# EAGLE schematic crap (EAGLE 9.3.1)
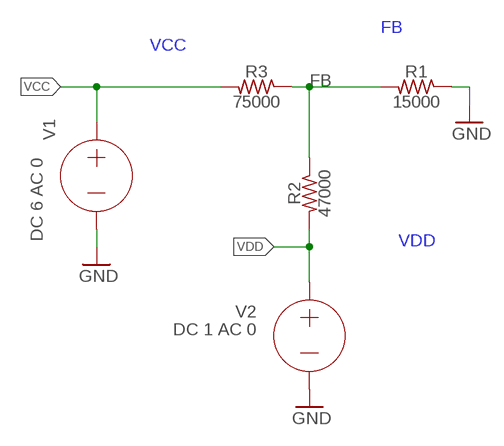
[diagram p0: schematic, sheet 1]

## Parts
R1  15000  RESISTORR0402  [R0402]
R2  47000  RESISTORR0402  [R0402]
R3  75000  RESISTORR0402  [R0402]
V1  DC 6 AC 0  VOLTAGE  (no package)
V2  DC 1 AC 0  VOLTAGE  (no package)

## Nets
FB: R1.2 R2.1 R3.1
GND: R1.1 V1.- V2.-
VCC: R3.2 V1.+
VDD: R2.2 V2.+

## Library data of the parts
R1-R3 = a_parts:RESISTOR: RESISTOR, American symbol; SPICEPREFIX: R
V1 V2 = ngspice-simulation:VOLTAGE: Independent Voltage Source, either DC, AC, PULSE, SINE, PWL, EXP, or SFFM; VALUE: 0V